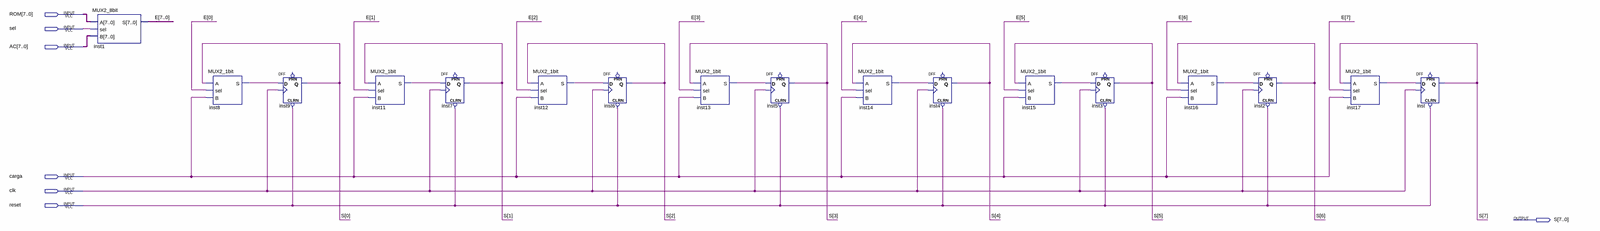
[diagram p0: schematic sheet, whole]
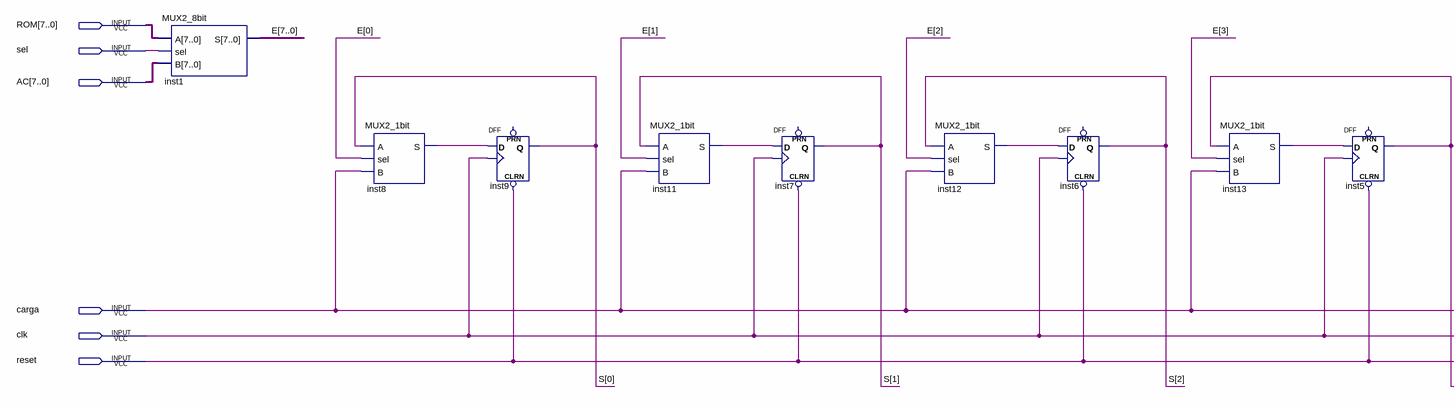
[diagram p1: schematic sheet, left part]
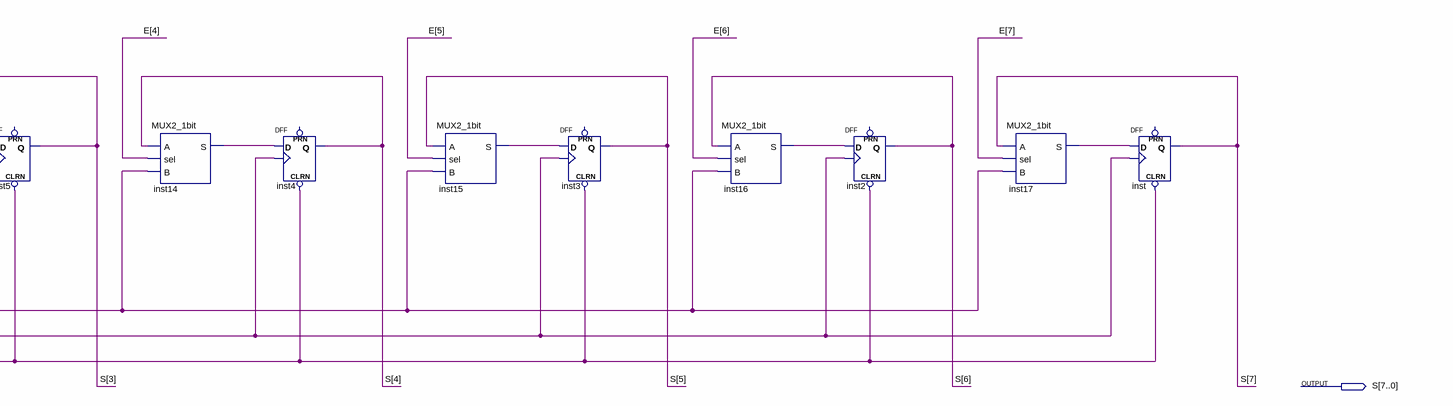
[diagram p2: schematic sheet, right part]
// Quartus schematic RDM.bdf as structural Verilog: 17 symbols, 7 pins
module RDM (
  input  [7:0] ROM,
  input  sel,
  input  [7:0] AC,
  input  carga,
  input  clk,
  input  reset,
  output [7:0] S
);

  wire inst8_s, inst11_s, inst12_s, inst13_s, inst14_s, inst15_s, inst16_s, inst17_s;
  wire [7:0] E;

  MUX2_8bit inst1 (.A(ROM), .sel(sel), .B(AC), .S(E));
  MUX2_1bit inst8 (.A(S[0]), .sel(E[0]), .B(carga), .S(inst8_s));
  DFF inst9 (.CLRN(reset), .CLK(clk), .D(inst8_s), .Q(S[0]));  // open: PRN
  MUX2_1bit inst11 (.A(S[1]), .sel(E[1]), .B(carga), .S(inst11_s));
  DFF inst7 (.CLRN(reset), .CLK(clk), .D(inst11_s), .Q(S[1]));  // open: PRN
  MUX2_1bit inst12 (.A(S[2]), .sel(E[2]), .B(carga), .S(inst12_s));
  DFF inst6 (.CLRN(reset), .CLK(clk), .D(inst12_s), .Q(S[2]));  // open: PRN
  MUX2_1bit inst13 (.A(S[3]), .sel(E[3]), .B(carga), .S(inst13_s));
  DFF inst5 (.CLRN(reset), .CLK(clk), .D(inst13_s), .Q(S[3]));  // open: PRN
  MUX2_1bit inst14 (.A(S[4]), .sel(E[4]), .B(carga), .S(inst14_s));
  DFF inst4 (.CLRN(reset), .CLK(clk), .D(inst14_s), .Q(S[4]));  // open: PRN
  MUX2_1bit inst15 (.A(S[5]), .sel(E[5]), .B(carga), .S(inst15_s));
  DFF inst3 (.CLRN(reset), .CLK(clk), .D(inst15_s), .Q(S[5]));  // open: PRN
  MUX2_1bit inst16 (.A(S[6]), .sel(E[6]), .B(carga), .S(inst16_s));
  DFF inst2 (.CLRN(reset), .CLK(clk), .D(inst16_s), .Q(S[6]));  // open: PRN
  MUX2_1bit inst17 (.A(S[7]), .sel(E[7]), .B(carga), .S(inst17_s));
  DFF inst (.CLRN(reset), .CLK(clk), .D(inst17_s), .Q(S[7]));  // open: PRN
endmodule
